# Altium schematic sheet Sigmux.SchDoc
size A4
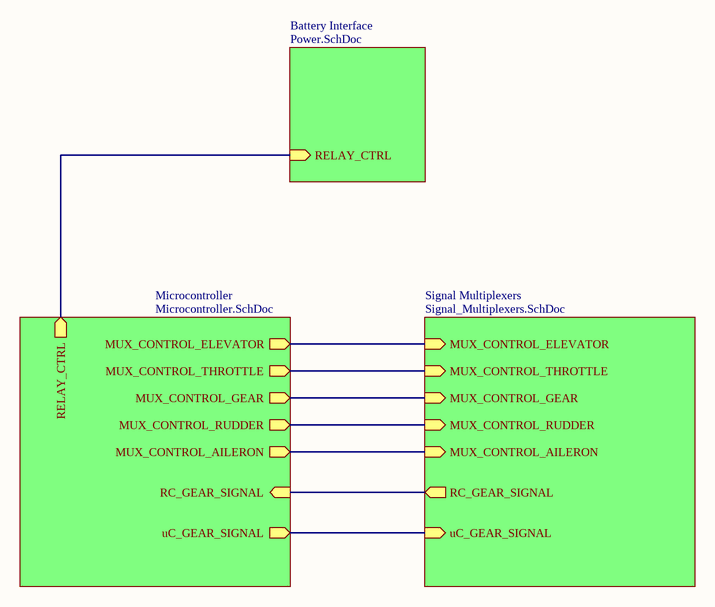
[diagram p0: Sigmux.SchDoc]

## Sub-sheets
Battery Interface = Power.SchDoc: RELAY_CTRL (in)
Microcontroller = Microcontroller.SchDoc: MUX_CONTROL_ELEVATOR (out), MUX_CONTROL_THROTTLE (out), MUX_CONTROL_GEAR (out), RC_GEAR_SIGNAL (in), uC_GEAR_SIGNAL (out), RELAY_CTRL (out), MUX_CONTROL_RUDDER (out), MUX_CONTROL_AILERON (out)
Signal Multiplexers = Signal_Multiplexers.SchDoc: MUX_CONTROL_ELEVATOR (in), MUX_CONTROL_THROTTLE (in), MUX_CONTROL_GEAR (in), RC_GEAR_SIGNAL (out), uC_GEAR_SIGNAL (in), MUX_CONTROL_RUDDER (in), MUX_CONTROL_AILERON (in)

## Nets
(unnamed): sheet Microcontroller/MUX_CONTROL_ELEVATOR, sheet Signal Multiplexers/MUX_CONTROL_ELEVATOR
(unnamed): sheet Microcontroller/MUX_CONTROL_THROTTLE, sheet Signal Multiplexers/MUX_CONTROL_THROTTLE
(unnamed): sheet Microcontroller/MUX_CONTROL_GEAR, sheet Signal Multiplexers/MUX_CONTROL_GEAR
(unnamed): sheet Microcontroller/RC_GEAR_SIGNAL, sheet Signal Multiplexers/RC_GEAR_SIGNAL
(unnamed): sheet Microcontroller/uC_GEAR_SIGNAL, sheet Signal Multiplexers/uC_GEAR_SIGNAL
(unnamed): sheet Microcontroller/RELAY_CTRL, sheet Battery Interface/RELAY_CTRL
(unnamed): sheet Microcontroller/MUX_CONTROL_RUDDER, sheet Signal Multiplexers/MUX_CONTROL_RUDDER
(unnamed): sheet Microcontroller/MUX_CONTROL_AILERON, sheet Signal Multiplexers/MUX_CONTROL_AILERON

## Notes on the sheet
- Title
- Size:
- Date:
- A4
- Number:
- Time:
- Revision:
- Sheet
- of
- File: